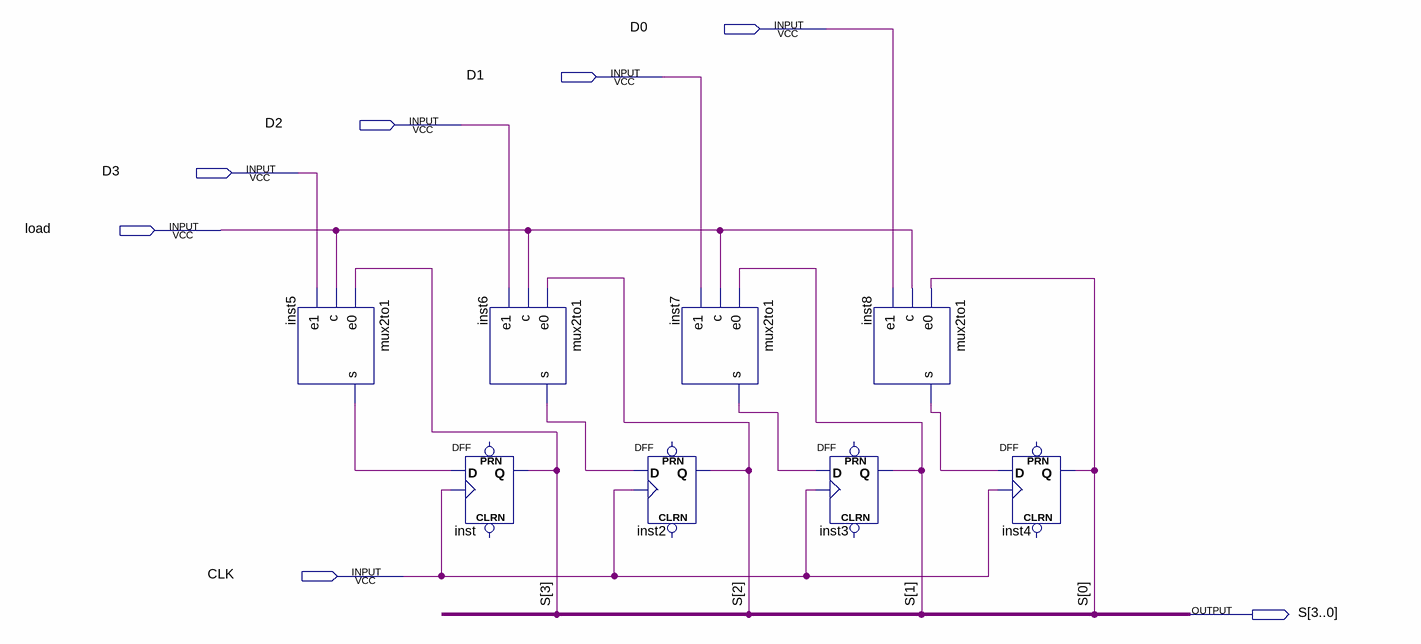
[diagram p0: schematic sheet]
// Quartus schematic reg4bits.bdf as structural Verilog: 8 symbols, 7 pins
module reg4bits (
  input  D0,
  input  D1,
  input  D2,
  input  D3,
  input  load,
  input  CLK,
  output [3:0] S
);

  wire inst5_s, inst6_s, inst7_s, inst8_s;

  mux2to1 inst5 (.e0(S[3]), .c(load), .e1(D3), .s(inst5_s));
  DFF inst (.CLK(CLK), .D(inst5_s), .Q(S[3]));  // open: CLRN, PRN
  mux2to1 inst6 (.e0(S[2]), .c(load), .e1(D2), .s(inst6_s));
  mux2to1 inst7 (.e0(S[1]), .c(load), .e1(D1), .s(inst7_s));
  DFF inst2 (.CLK(CLK), .D(inst6_s), .Q(S[2]));  // open: CLRN, PRN
  DFF inst3 (.CLK(CLK), .D(inst7_s), .Q(S[1]));  // open: CLRN, PRN
  mux2to1 inst8 (.e0(S[0]), .c(load), .e1(D0), .s(inst8_s));
  DFF inst4 (.CLK(CLK), .D(inst8_s), .Q(S[0]));  // open: CLRN, PRN
endmodule
